# EAGLE design H40R00 (EAGLE 9.6.1)
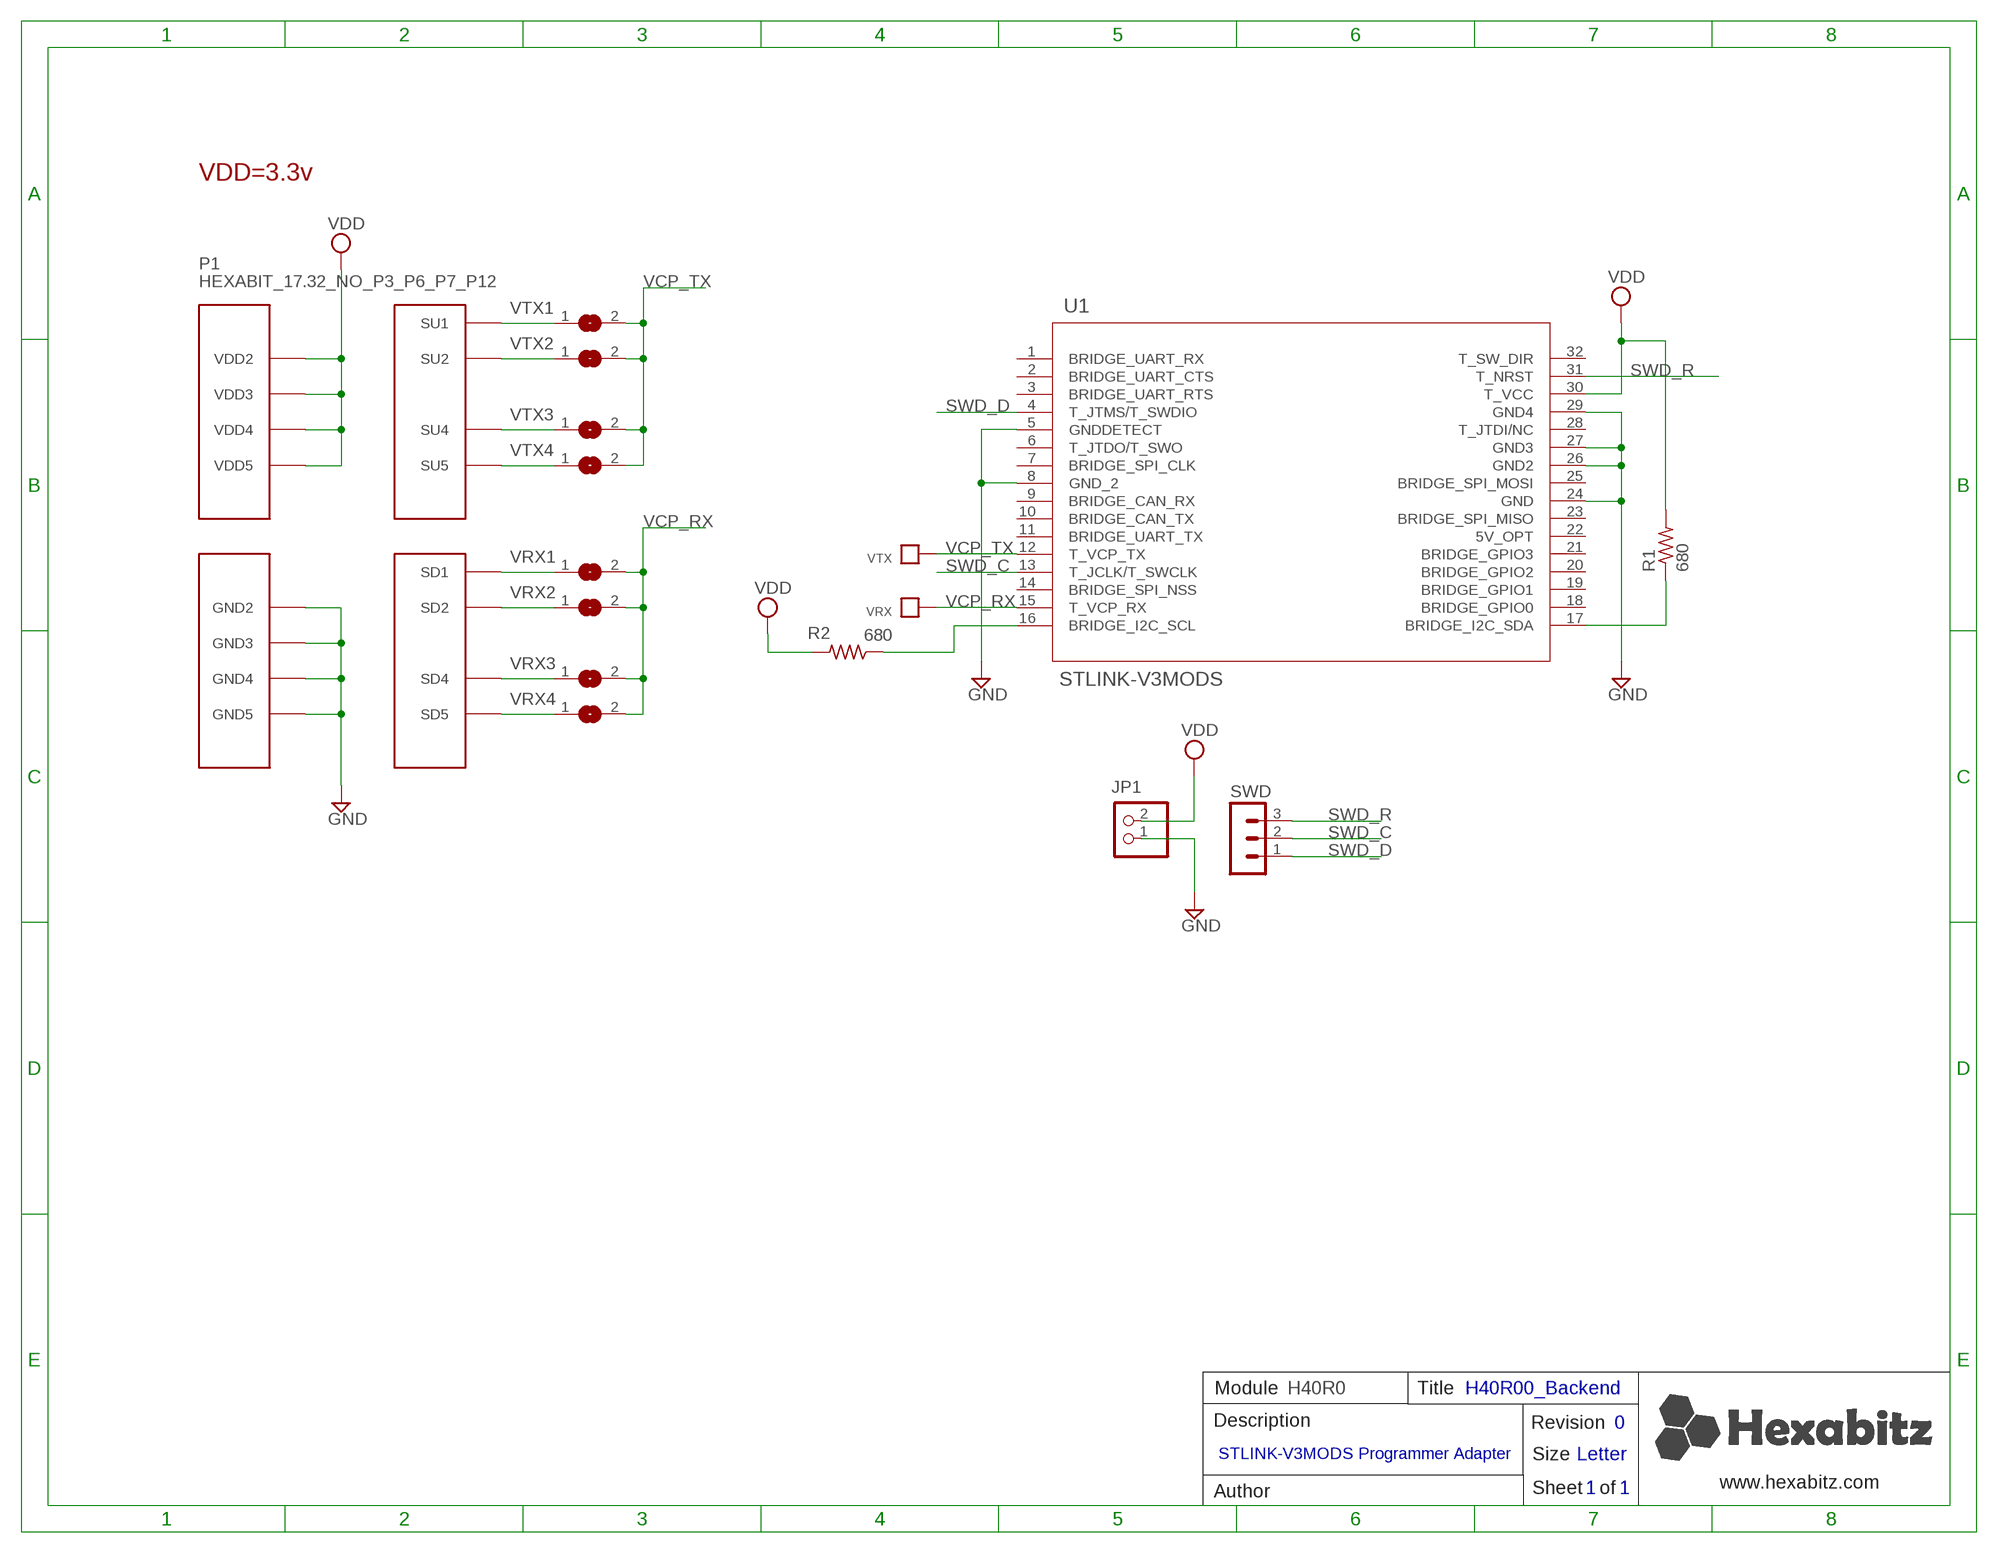
[diagram p0: schematic, sheet 1]

## Parts
JP1  PINHD-1X2  [1X02]
P1  HEXABIT_17.32_NO_P3_P6_P7_P12  [HEXABIT_17.32_NO_P3_P6_P7_P12]
R1  680  R-0603  [R-0603]
R2  680  R-0603  [R-0603]
SWD  MA03-1  [MA03-1]
U1  STLINK-V3MODS  [MOD_STLINK-V3M_MB1467]
VRX  PAD4  [PAD4]
VRX1  SJ  [SJ]
VRX2  SJ  [SJ]
VRX3  SJ  [SJ]
VRX4  SJ  [SJ]
VTX  PAD4  [PAD4]
VTX1  SJ  [SJ]
VTX2  SJ  [SJ]
VTX3  SJ  [SJ]
VTX4  SJ  [SJ]

## Nets
GND: JP1.1 P1.PAD_PD8(GND2) P1.PAD_PD9(GND3) P1.PAD_PD10(GND4) P1.PAD_PD11(GND5) U1.5(GNDDETECT) U1.8(GND_2) U1.24(GND) U1.26(GND2) U1.27(GND3) U1.29(GND4)
N$10: R2.1 U1.16(BRIDGE_I2C_SCL)
N$13: R1.1 U1.17(BRIDGE_I2C_SDA)
SWD_C: SWD.2 U1.13(T_JCLK/T_SWCLK)
SWD_D: SWD.1 U1.4(T_JTMS/T_SWDIO)
SWD_R: SWD.3 U1.31(T_NRST)
UART2_RX: P1.PAD_PD1(SD1) VRX1.1
UART2_TX: P1.PAD_PU1(SU1) VTX1.1
UART3_RX: P1.PAD_PD4(SD4) VRX3.1
UART3_TX: P1.PAD_PU4(SU4) VTX3.1
UART4_RX: P1.PAD_PD5(SD5) VRX4.1
UART4_TX: P1.PAD_PU5(SU5) VTX4.1
UART6_RX: P1.PAD_PD2(SD2) VRX2.1
UART6_TX: P1.PAD_PU2(SU2) VTX2.1
VCP_RX: U1.15(T_VCP_RX) VRX1.2 VRX2.2 VRX3.2 VRX4.2 VRX.P$1
VCP_TX: U1.12(T_VCP_TX) VTX1.2 VTX2.2 VTX3.2 VTX4.2 VTX.P$1
VDD: JP1.2 P1.PAD_PU8(VDD2) P1.PAD_PU9(VDD3) P1.PAD_PU10(VDD4) P1.PAD_PU11(VDD5) R1.2 R2.2 U1.30(T_VCC)
Unconnected: U1.1(BRIDGE_UART_RX) U1.2(BRIDGE_UART_CTS) U1.3(BRIDGE_UART_RTS) U1.6(T_JTDO/T_SWO) U1.7(BRIDGE_SPI_CLK) U1.9(BRIDGE_CAN_RX) U1.10(BRIDGE_CAN_TX) U1.11(BRIDGE_UART_TX) U1.14(BRIDGE_SPI_NSS) U1.18(BRIDGE_GPIO0) U1.19(BRIDGE_GPIO1) U1.20(BRIDGE_GPIO2) U1.21(BRIDGE_GPIO3) U1.22(5V_OPT) U1.23(BRIDGE_SPI_MISO) U1.25(BRIDGE_SPI_MOSI) U1.28(T_JTDI/NC) U1.32(T_SW_DIR)

## Notes on the sheet
- VDD=3.3v
- Module | H40R0 | Title | H40R00_Backend
- Description | Revision | 0
- STLINK-V3MODS Programmer Adapter
- Size | Letter
- www.hexabitz.com
- Author | Sheet   of | 1 | 1
- C:/Users/Admin/Desktop/logodraft.bmp

## Library data of the parts
JP1 = pinhead:PINHD-1X2: PIN HEADER
P1 = hexabitz_connectors:HEXABIT_?_NO_P3_P6_P7_P12: Hexabitz Hexagon Module Connector Hexagon side length = 17.32mm. The following ports are removed: P3 P6 P7 P12
R1 R2 = HEXABITZ_RCLS:R-0603: Thick Film Resistors - SMD 0603; MFN: Yageo; MPN: RC0603JR-07680RL; OCTOPART_URL: https://octopart.com/rc0603jr-07680rl-yageo-40953172?r=sp; RESISTANCE: 680; TOLERANCE: 5%
SWD = con-lstb:MA03-1: PIN HEADER; OC_FARNELL: unknown; OC_NEWARK: unknown
U1 = HEXABITZ_ICs:STLINK-V3MODS; MANUFACTURER_PART_NUMBER: STLINKV3MOS; VENDOR: STMicroelectronics
VRX VTX = HEXABITZ_CONNECTION_PARTS:PAD4
VRX1-VRX4 VTX1-VTX4 = jumper:SJ: SMD solder JUMPER

## Board
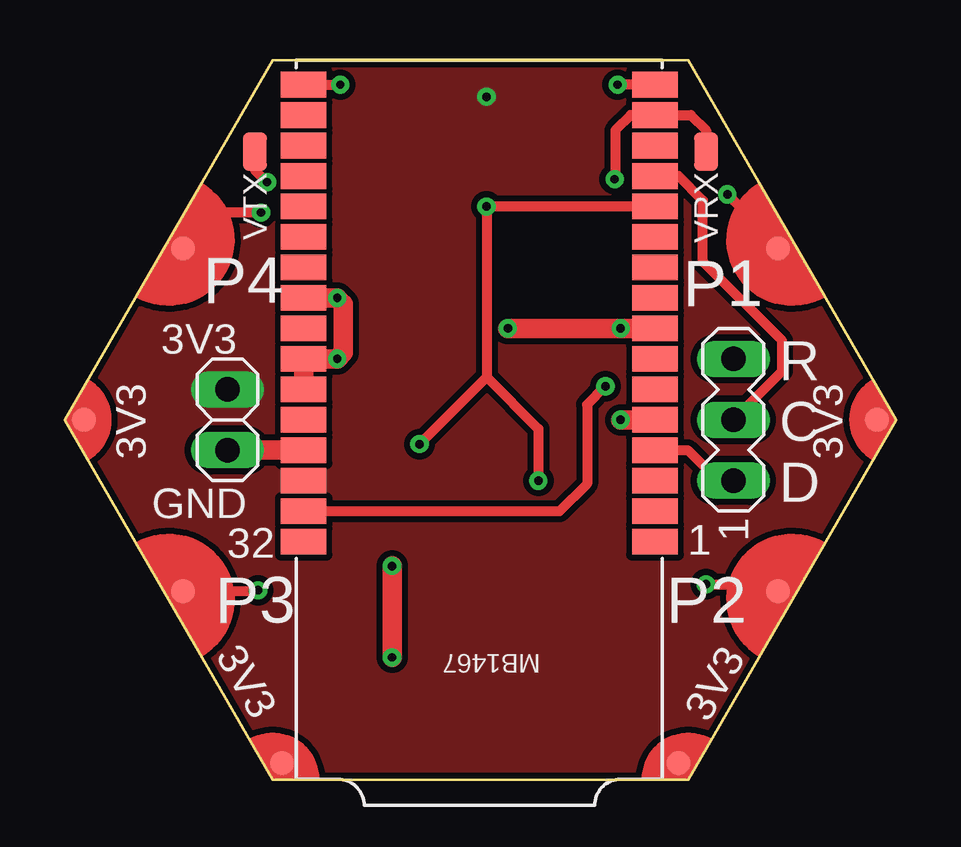
[diagram p1: board, top side]
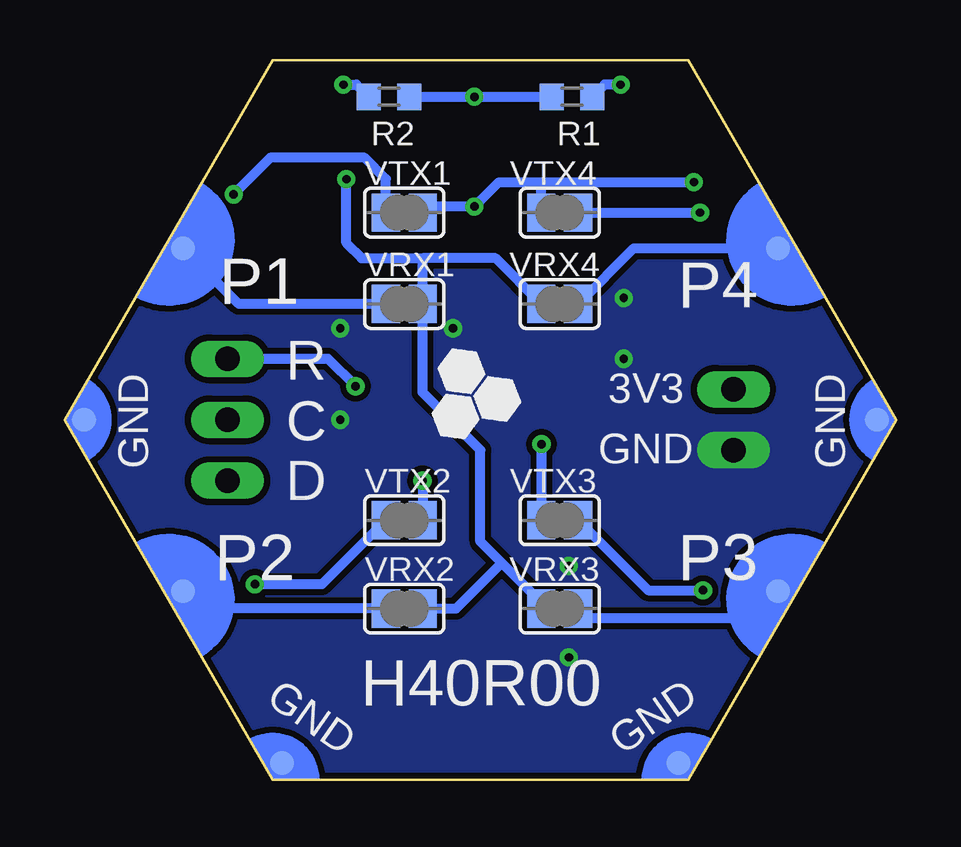
[diagram p2: board, bottom side, seen from below]

Size 34.64 x 30 mm. Coordinates in mm from the lower left corner, seen from the top.
Copper layers (1*16): Top 0.035mm / dielectric 1.5mm / Bottom 0.035mm
Design rules "2_layer *": minimum track width 7mil, minimum drill 10mil, track to track 6mil, track to pad 6mil, pad to pad 6mil, via to via 6mil, smd to smd 0mil, copper to edge 1mil, drill to drill 8mil, minimum pad ring 10mil, minimum via ring 8mil, stop-mask expansion 2mil, vias tented up to drill 15mil, thermal gap 10mil

### Footprints (pad centres in the part's own frame; a part is rotated, then mirrored left to right if it is on the bottom)
1X02 = drill 1.016 long: 1 -1.27,0; 2 1.27,0
HEXABIT_17.32_NO_P3_P6_P7_P12 = smd 1 x 1 bottom: PAD_PD1 12.39,7.15; PAD_PD2 12.39,-7.15; PAD_PD4 -12.39,-7.15; PAD_PD5 -12.39,7.15; PAD_PD8 16.52,0; PAD_PD9 8.26,-14.31; PAD_PD10 -8.26,-14.31; PAD_PD11 -16.52,0 | smd 1 x 1: PAD_PU1 12.39,7.15; PAD_PU2 12.39,-7.15; PAD_PU4 -12.39,-7.15; PAD_PU5 -12.39,7.15; PAD_PU8 16.52,0; PAD_PU9 8.26,-14.31; PAD_PU10 -8.26,-14.31; PAD_PU11 -16.52,0
R-0603 = smd 1 x 1.1: 1 -0.85,0; 2 0.85,0
MA03-1 = drill 1.016 long: 1 -2.54,0; 2 0,0; 3 2.54,0
MOD_STLINK-V3M_MB1467 = smd 1.9 x 1.07: 1 -7.32,-9.906; 2 -7.32,-11.176; 3 -7.32,-12.446; 4 -7.32,-13.716; 5 -7.32,-14.986; 6 -7.32,-16.256; 7 -7.32,-17.526; 8 -7.32,-18.796; 9 -7.32,-20.066; 10 -7.32,-21.336; 11 -7.32,-22.606; 12 -7.32,-23.876; 13 -7.32,-25.146; 14 -7.32,-26.416; 15 -7.32,-27.686; 16 -7.32,-28.956; 17 7.32,-28.956; 18 7.32,-27.686; 19 7.32,-26.416; 20 7.32,-25.146; 21 7.32,-23.876; 22 7.32,-22.606; 23 7.32,-21.336; 24 7.32,-20.066; 25 7.32,-18.796; 26 7.32,-17.526; 27 7.32,-16.256; 28 7.32,-14.986; 29 7.32,-13.716; 30 7.32,-12.446; 31 7.32,-11.176; 32 7.32,-9.906
PAD4 = smd 1.6 x 1: P$1 0,0
SJ = smd 1.168 x 1.6: 1 -0.762,0; 2 0.762,0

### Placement (x,y rotation side)
JP1  6.78,15 90 top
P1  17.32,15 0 top
R1  13.51,28.46 180 bottom
R2  21.13,28.46 0 bottom
SWD  27.86,15 90 top
U1  17.27,0.01 180 top
VRX  26.72,26.18 90 top
VRX1  20.49,19.83 0 bottom
VRX2  20.49,7.13 0 bottom
VRX3  14.02,7.13 180 bottom
VRX4  14.02,19.83 180 bottom
VTX  7.92,26.18 90 top
VTX1  20.49,23.64 0 bottom
VTX2  20.49,10.81 0 bottom
VTX3  14.02,10.81 180 bottom
VTX4  14.02,23.64 180 bottom

### Tracks (layer width: path | path; a pad name or v marks a point on that pad's centre or on a via)
GND  (via drill 0.35)
  Top 0.813: U1.29 JP1.1 | U1.27 U1.26 v11.35,17.54 11.61,17.79 11.61,19.83 v11.35,20.08 U1.24 | U1.8 v23.16,18.81 v18.46,18.81 | U1.5 v23.16,15 | v13.64,8.9 v13.64,5.09
  pour Bottom (isolate 0.254, no thermals): 8.61,-0.05 25.93,-0.05 34.59,14.95 25.93,29.95 8.61,29.95 -0.05,14.95
N$10  (via drill 0.35)
  Top 0.406: U1.16 v23.04,28.97
  Bottom 0.406: v23.04,28.97 22.49,28.97 R2.1
N$13  (via drill 0.35)
  Top 0.406: U1.17 v11.48,28.97
  Bottom 0.406: v11.48,28.97 12.15,28.97 R1.1
SWD_C
  Top 0.406: SWD.2 29.89,17.03 29.89,18.3 26.59,21.6 26.59,24.14 25.58,25.16 U1.13
SWD_D
  Top 0.406: U1.4 25.96,13.73 27.23,12.46 SWD.1
SWD_R  (via drill 0.35)
  Top 0.406: U1.31 20.62,11.19 21.77,12.33 21.77,15.63 v22.53,16.4
  Bottom 0.406: v22.53,16.4 23.67,17.54 SWD.3
UART2_RX
  Bottom 0.406: VRX1.1 27.39,19.83 P1.PAD_PD1
UART2_TX  (via drill 0.35)
  Top 0.406: v27.61,24.4 29.71,22.3 P1.PAD_PU1
  Bottom 0.406: VTX1.1 21.26,25.03 22.15,25.92 26.08,25.92 v27.61,24.4
UART3_RX
  Bottom 0.406: P1.PAD_PD4 6.04,6.75 12.88,6.75 VRX3.1
UART3_TX  (via drill 0.35)
  Top 0.406: v8.05,7.89 8.01,7.85 P1.PAD_PU4
  Bottom 0.406: VTX3.1 10.34,7.89 v8.05,7.89
UART4_RX
  Bottom 0.406: P1.PAD_PD5 10.93,22.15 VRX4.1
UART4_TX  (via drill 0.35)
  Top 0.406: v8.18,23.64 6.53,23.64 5.04,22.15 P1.PAD_PU5
  Bottom 0.406: VTX4.1 v8.18,23.64
UART6_RX
  Bottom 0.406: VRX2.1 28.99,7.13 P1.PAD_PD2
UART6_TX  (via drill 0.35)
  Top 0.406: v26.72,8.14 29.42,8.14 P1.PAD_PU2
  Bottom 0.406: VTX2.1 23.92,8.14 v26.72,8.14
VCP_RX  (via drill 0.35)
  Top 0.406: v22.91,25.03 22.94,25.07 22.94,27.06 23.58,27.7 U1.15 26.08,27.7 26.72,27.06 VRX.P$1
  Bottom 0.406: 16.43,9.03 17.32,9.92 17.32,13.73 19.73,16.14 VRX1.2 19.73,21.73 | v22.91,25.03 22.91,22.37 22.27,21.73 19.73,21.73 | VRX2.2 18.34,7.13 16.43,9.03 | VRX3.2 14.78,7.38 16.43,9.03 | VRX4.2 16.69,21.73 19.73,21.73
VCP_TX  (via drill 0.35)
  Top 0.406: U1.12 v17.57,23.89 17.57,16.78 | v8.43,24.91 7.92,25.41 VTX.P$1 | 17.57,16.78 v14.78,13.98 | 17.57,16.78 19.73,14.62 v19.73,12.46
  Bottom 0.406: VTX1.2 19.48,23.89 v17.57,23.89 16.56,24.91 14.91,24.91 | 14.91,24.91 v8.43,24.91 | 14.91,24.91 14.78,24.78 VTX4.2 | v14.78,13.98 VTX3.2 | v19.73,12.46 VTX2.2
VDD  (via drill 0.35)
  Bottom 0.406: R2.2 v17.57,28.46 R1.2
  pour Top (isolate 0.254, rank 2, no thermals): 8.61,-0.05 25.93,-0.05 34.59,14.95 25.93,29.95 8.59,29.95 -0.06,14.97

### Text on the board
tPlace: P4 | P1 | 3V3 | 3V3 | 3V3 | GND | 32 | 1 | P3 | P2 | 3V3 | 3V3
bPlace: P4 | P1 | 3V3 | GND | GND | GND | P3 | P2 | H40R00 | GND | GND
tNames: R | C | D
bNames: R | C | D